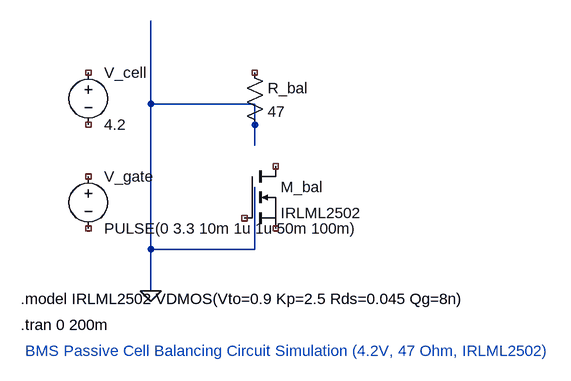
[diagram p0: schematic cell_balancing.asc]
cell_balancing.asc, the LTspice schematic file:
Version 4
SHEET 1 880 680
WIRE 0 -64 0 -128
WIRE 0 0 0 -64
WIRE 160 0 0 0
WIRE 160 64 160 0
WIRE 160 160 160 128
WIRE 160 224 160 160
WIRE 0 224 160 224
WIRE 0 224 0 0
WIRE 0 288 0 224
FLAG 0 288 0
SYMBOL res 144 -64 R0
SYMATTR InstName R_bal
SYMATTR Value 47
SYMBOL nmos 144 96 R0
SYMATTR InstName M_bal
SYMATTR Value IRLML2502
SYMBOL voltage -96 -64 R0
SYMATTR InstName V_cell
SYMATTR Value 4.2
SYMBOL voltage -96 96 R0
SYMATTR InstName V_gate
SYMATTR Value PULSE(0 3.3 10m 1u 1u 50m 100m)
TEXT -200 300 Left 2 !.model IRLML2502 VDMOS(Vto=0.9 Kp=2.5 Rds=0.045 Qg=8n)
TEXT -200 340 Left 2 !.tran 0 200m
TEXT -200 380 Left 2 ; BMS Passive Cell Balancing Circuit Simulation (4.2V, 47 Ohm, IRLML2502)

The netlist it stands for:
* cell_balancing.asc
R_bal NC_01 0 47
* M_bal: IRLML2502 (symbol nmos not certain, pin order unknown); nets seen at it: 
V_cell NC_05 NC_06 4.2
V_gate NC_07 NC_08 PULSE(0 3.3 10m 1u 1u 50m 100m)
.model IRLML2502 VDMOS(Vto=0.9 Kp=2.5 Rds=0.045 Qg=8n)
.tran 0 200m
*  BMS Passive Cell Balancing Circuit Simulation (4.2V, 47 Ohm, IRLML2502)
.backanno
.end